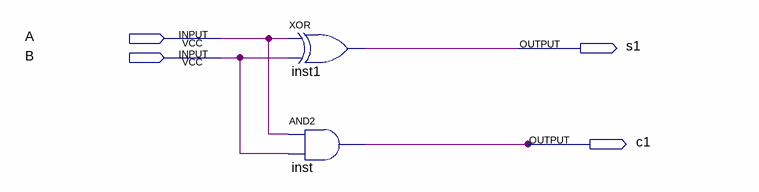
[diagram p0: schematic sheet]
// Quartus schematic half_adder.bdf as structural Verilog: 2 symbols, 4 pins
module half_adder (
  input  A,
  input  B,
  output s1,
  output c1
);

  xor inst1 (s1, A, B);
  and inst (c1, A, B);
endmodule
